# EAGLE design miniga_v1.1 (EAGLE 4.16)
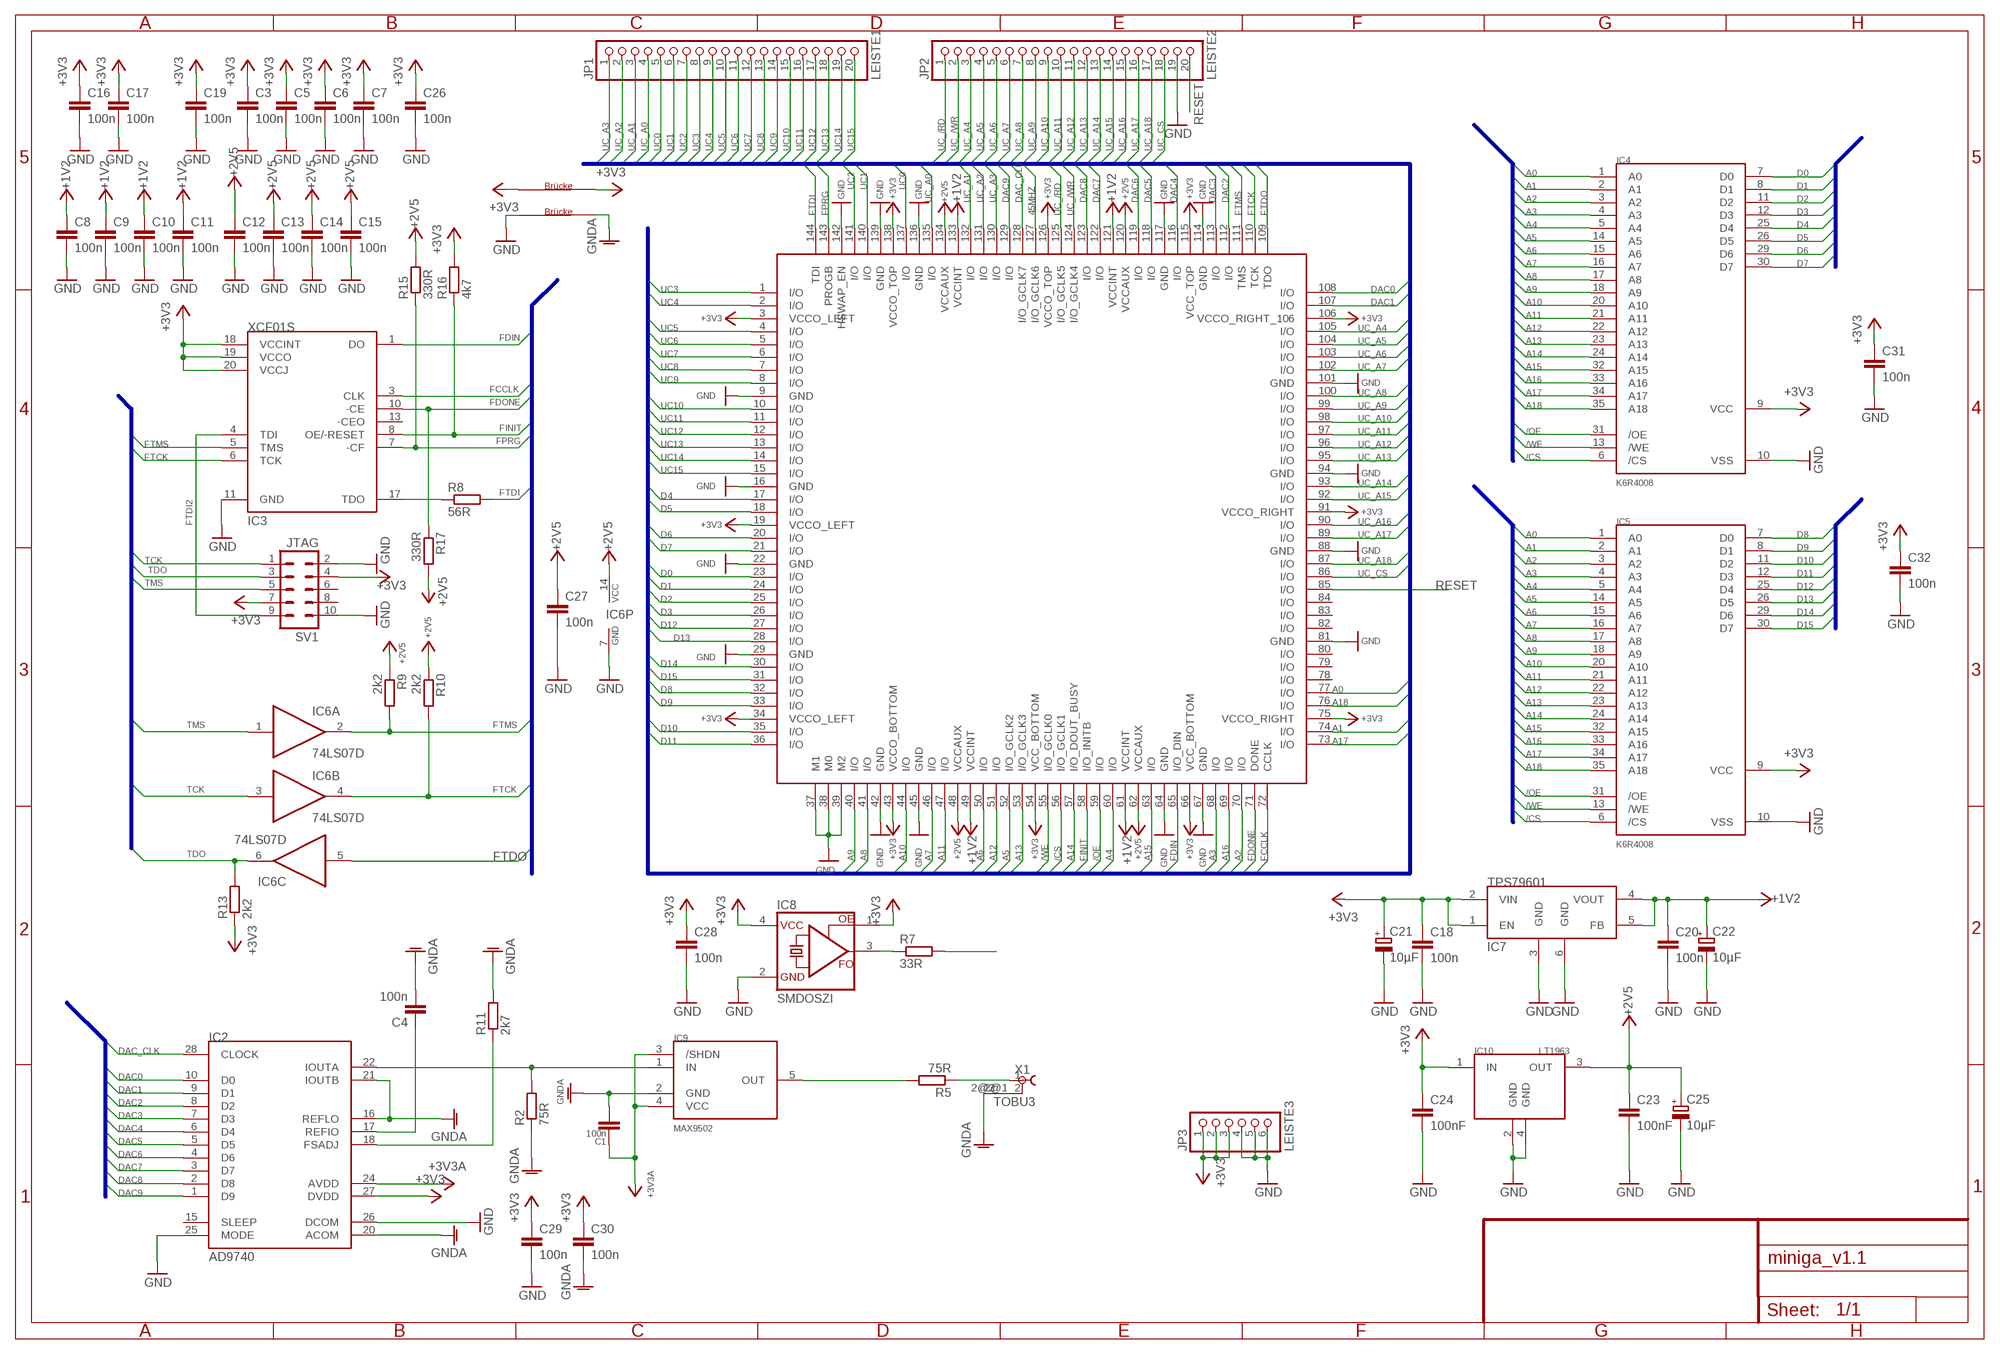
[diagram p0: schematic, sheet 1]

## Parts
C1  100n  C-EUC1206  [C1206]
C3  100n  C-EUC0603  [C0603]
C4  100n  C-EUC1206  [C1206]
C5  100n  C-EUC0603  [C0603]
C6  100n  C-EUC0603  [C0603]
C7  100n  C-EUC0603  [C0603]
C8  100n  C-EUC0603  [C0603]
C9  100n  C-EUC0603  [C0603]
C10  100n  C-EUC0603  [C0603]
C11  100n  C-EUC0603  [C0603]
C12  100n  C-EUC0603  [C0603]
C13  100n  C-EUC0603  [C0603]
C14  100n  C-EUC0603  [C0603]
C15  100n  C-EUC0603  [C0603]
C16  100n  C-EUC0603  [C0603]
C17  100n  C-EUC0603  [C0603]
C18  100n  C-EUC1206  [C1206]
C19  100n  C-EUC0603  [C0603]
C20  100n  C-EUC1206  [C1206]
C21  10µF  CPOL-EUCT6032  [CT6032]
C22  10µF  CPOL-EUCT6032  [CT6032]
C23  100nF  C-EUC1206  [C1206]
C24  100nF  C-EUC1206  [C1206]
C25  10µF  CPOL-EUCT6032  [CT6032]
C26  100n  C-EUC0603  [C0603]
C27  100n  C-EUC1206  [C1206]
C28  100n  C-EUC1206  [C1206]
C29  100n  C-EUC0603  [C0603]
C30  100n  C-EUC0603  [C0603]
C31  100n  C-EUC0603  [C0603]
C32  100n  C-EUC0603  [C0603]
IC1  XC3S200  [TQFP144]
IC2  AD9740  [SOIC28L]
IC3  XCF01S  [TSSOP20]
IC4  K6R4008  [SOJ36]
IC5  K6R4008  [SOJ36]
IC6  74LS07D  [SO14]
IC7  TPS79601  [SOT223-6]
IC8  SMDOSZI  [CRYSTAL]
IC9  MAX9502  [SC70-5]
IC10  LT1963  [SOT223]
JP1  LEISTE1  PINHD-1X20  [1X20]
JP2  LEISTE2  PINHD-1X20  [1X20]
JP3  LEISTE3  PINHD-1X6  [1X06]
JP4  BRUECKE  [BRUECKE]
JP5  BRUECKE  [BRUECKE]
R2  75R  R-EU_M1206  [M1206]
R5  75R  R-EU_M1206  [M1206]
R7  33R  R-EU_R1206  [R1206]
R8  56R  R-EU_M1206  [M1206]
R9  2k2  R-EU_R1206  [R1206]
R10  2k2  R-EU_R1206  [R1206]
R11  2k7  R-EU_M1206  [M1206]
R13  2k2  R-EU_R1206  [R1206]
R15  330R  R-EU_R1206  [R1206]
R16  4k7  R-EU_R1206  [R1206]
R17  330R  R-EU_R1206  [R1206]
SV1  JTAG  ML10  [ML10]
X1  TOBU3  [TOBU3]

## Nets
45MHZ: IC1.127(I/O_GCLK6) R7.2
+1V2: C8.1 C9.1 C10.1 C11.1 C20.1 C22.+ IC1.49(VCCINT) IC1.61(VCCINT) IC1.121(VCCINT) IC1.133(VCCINT) IC7.4(VOUT) IC7.5(FB)
+2V5: C12.1 C13.1 C14.1 C15.1 C23.1 C25.+ C27.1 IC1.48(VCCAUX) IC1.62(VCCAUX) IC1.120(VCCAUX) IC1.134(VCCAUX) IC6.14(P:VCC) IC10.3(OUT) R9.1 R10.1 R15.2 R17.2
+3V3: C3.1 C5.1 C6.1 C7.1 C16.1 C17.1 C18.1 C19.1 C21.+ C24.1 C26.1 C28.1 C29.1 C31.1 C32.1 IC1.3(VCCO_LEFT) IC1.19(VCCO_LEFT) IC1.34(VCCO_LEFT) IC1.43(VCCO_BOTTOM) IC1.54(VCC_BOTTOM) IC1.66(VCC_BOTTOM) IC1.75(VCCO_RIGHT) IC1.91(VCCO_RIGHT) IC1.106(VCCO_RIGHT_106) IC1.115(VCC_TOP) IC1.126(VCCO_TOP) IC1.138(VCCO_TOP) IC2.27(DVDD) IC3.18(VCCINT) IC3.19(VCCO) IC3.20(VCCJ) IC4.9(VCC) IC5.9(VCC) IC7.1(EN) IC7.2(VIN) IC8.1(OE) IC8.4(VCC) IC10.1(IN) JP3.1 JP3.2 JP3.3 JP4.1 R13.1 R16.2 SV1.4 SV1.7
+3V3A: C1.1 C30.1 IC2.24(AVDD) IC9.3(/SHDN) IC9.4(VCC) JP4.2 ; supply symbol labelled +3V3
/CS: IC1.56(I/O_GCLK1) IC4.6(/CS) IC5.6(/CS)
/OE: IC1.59(I/O) IC4.31(/OE) IC5.31(/OE)
/WE: IC1.55(I/O_GCLK0) IC4.13(/WE) IC5.13(/WE)
A0: IC1.77(I/O) IC4.1(A0) IC5.1(A0)
A1: IC1.74(I/O) IC4.2(A1) IC5.2(A1)
A2: IC1.70(I/O) IC4.3(A2) IC5.3(A2)
A3: IC1.68(I/O) IC4.4(A3) IC5.4(A3)
A4: IC1.60(I/O) IC4.5(A4) IC5.5(A4)
A5: IC1.52(I/O_GCLK2) IC4.14(A5) IC5.14(A5)
A6: IC1.50(I/O) IC4.15(A6) IC5.15(A6)
A7: IC1.46(I/O) IC4.16(A7) IC5.16(A7)
A8: IC1.41(I/O) IC4.17(A8) IC5.17(A8)
A9: IC1.40(I/O) IC4.18(A9) IC5.18(A9)
A10: IC1.44(I/O) IC4.20(A10) IC5.20(A10)
A11: IC1.47(I/O) IC4.21(A11) IC5.21(A11)
A12: IC1.51(I/O) IC4.22(A12) IC5.22(A12)
A13: IC1.53(I/O_GCLK3) IC4.23(A13) IC5.23(A13)
A14: IC1.57(I/O_DOUT_BUSY) IC4.24(A14) IC5.24(A14)
A15: IC1.63(I/O) IC4.32(A15) IC5.32(A15)
A16: IC1.69(I/O) IC4.33(A16) IC5.33(A16)
A17: IC1.73(I/O) IC4.34(A17) IC5.34(A17)
A18: IC1.76(I/O) IC4.35(A18) IC5.35(A18)
D0: IC1.23(I/O) IC4.7(D0)
D1: IC1.24(I/O) IC4.8(D1)
D2: IC1.25(I/O) IC4.11(D2)
D3: IC1.26(I/O) IC4.12(D3)
D4: IC1.17(I/O) IC4.25(D4)
D5: IC1.18(I/O) IC4.26(D5)
D6: IC1.20(I/O) IC4.29(D6)
D7: IC1.21(I/O) IC4.30(D7)
D8: IC1.32(I/O) IC5.7(D0)
D9: IC1.33(I/O) IC5.8(D1)
D10: IC1.35(I/O) IC5.11(D2)
D11: IC1.36(I/O) IC5.12(D3)
D12: IC1.27(I/O) IC5.25(D4)
D13: IC1.28(I/O) IC5.26(D5)
D14: IC1.30(I/O) IC5.29(D6)
D15: IC1.31(I/O) IC5.30(D7)
DAC0: IC1.108(I/O) IC2.10(D0)
DAC1: IC1.107(I/O) IC2.9(D1)
DAC2: IC1.112(I/O) IC2.8(D2)
DAC3: IC1.113(I/O) IC2.7(D3)
DAC4: IC1.116(I/O) IC2.6(D4)
DAC5: IC1.118(I/O) IC2.5(D5)
DAC6: IC1.119(I/O) IC2.4(D6)
DAC7: IC1.122(I/O) IC2.3(D7)
DAC8: IC1.123(I/O) IC2.2(D8)
DAC9: IC1.129(I/O) IC2.1(D9)
DAC_CLK: IC1.128(I/O_GCLK7) IC2.28(CLOCK)
FCCLK: IC1.72(CCLK) IC3.3(CLK)
FDIN: IC1.65(I/O_DIN) IC3.1(DO)
FDONE: IC1.71(DONE) IC3.10(-CE) R17.1
FINIT: IC1.58(I/O_INITB) IC3.8(OE/-RESET) R16.1
FPRG: IC1.143(PROGB) IC3.7(-CF) R15.1
FTCK: IC1.110(TCK) IC3.6(TCK) IC6.4(B:O) R10.2
FTDI: IC1.144(TDI) R8.2
FTDI2: IC3.4(TDI) SV1.9
FTDO: IC1.109(TDO) IC6.5(C:I)
FTMS: IC1.111(TMS) IC3.5(TMS) IC6.2(A:O) R9.2
GND: C3.2 C5.2 C6.2 C7.2 C8.2 C9.2 C10.2 C11.2 C12.2 C13.2 C14.2 C15.2 C16.2 C17.2 C18.2 C19.2 C20.2 C21.- C22.- C23.2 C24.2 C25.- C26.2 C27.2 C28.2 C29.2 C31.2 C32.2 IC1.9(GND) IC1.16(GND) IC1.22(GND) IC1.29(GND) IC1.37(M1) IC1.38(M0) IC1.39(M2) IC1.42(GND) IC1.45(GND) IC1.64(GND) IC1.67(GND) IC1.81(GND) IC1.88(GND) IC1.94(GND) IC1.101(GND) IC1.114(GND) IC1.117(GND) IC1.136(GND) IC1.139(GND) IC1.142(HSWAP_EN) IC2.25(MODE) IC2.26(DCOM) IC3.11(GND) IC4.10(VSS) IC5.10(VSS) IC6.7(P:GND) IC7.3(GND) IC7.6(GND) IC8.2(GND) IC10.2(GND) IC10.4(GND) JP2.19 JP3.4 JP3.5 JP3.6 JP5.1 SV1.2 SV1.10
GNDA: C1.2 C4.2 C30.2 IC2.16(REFLO) IC2.20(ACOM) IC2.21(IOUTB) IC9.2(GND) JP5.2 R2.1 R11.2 X1.2@2
N$3: IC9.5(OUT) R5.2
N$4: C4.1 IC2.17(REFIO)
N$6: R5.1 X1.1
N$7: IC8.3(FO) R7.1
N$8: IC3.17(TDO) R8.1
N$9: IC2.22(IOUTA) IC9.1(IN) R2.2
N$12: IC2.18(FSADJ) R11.1
RESET: IC1.85(I/O) JP2.20
TCK: IC6.3(B:I) SV1.1
TDO: IC6.6(C:O) R13.2 SV1.3
TMS: IC6.1(A:I) SV1.5
UC0: IC1.137(I/O) JP1.5
UC1: IC1.140(I/O) JP1.6
UC2: IC1.141(I/O) JP1.7
UC3: IC1.1(I/O) JP1.8
UC4: IC1.2(I/O) JP1.9
UC5: IC1.4(I/O) JP1.10
UC6: IC1.5(I/O) JP1.11
UC7: IC1.6(I/O) JP1.12
UC8: IC1.7(I/O) JP1.13
UC9: IC1.8(I/O) JP1.14
UC10: IC1.10(I/O) JP1.15
UC11: IC1.11(I/O) JP1.16
UC12: IC1.12(I/O) JP1.17
UC13: IC1.13(I/O) JP1.18
UC14: IC1.14(I/O) JP1.19
UC15: IC1.15(I/O) JP1.20
UC_/RD: IC1.125(I/O_GCLK5) JP2.1
UC_/WR: IC1.124(I/O_GCLK4) JP2.2
UC_A0: IC1.135(I/O) JP1.4
UC_A1: IC1.132(I/O) JP1.3
UC_A2: IC1.131(I/O) JP1.2
UC_A3: IC1.130(I/O) JP1.1
UC_A4: IC1.105(I/O) JP2.3
UC_A5: IC1.104(I/O) JP2.4
UC_A6: IC1.103(I/O) JP2.5
UC_A7: IC1.102(I/O) JP2.6
UC_A8: IC1.100(I/O) JP2.7
UC_A9: IC1.99(I/O) JP2.8
UC_A10: IC1.98(I/O) JP2.9
UC_A11: IC1.97(I/O) JP2.10
UC_A12: IC1.96(I/O) JP2.11
UC_A13: IC1.95(I/O) JP2.12
UC_A14: IC1.93(I/O) JP2.13
UC_A15: IC1.92(I/O) JP2.14
UC_A16: IC1.90(I/O) JP2.15
UC_A17: IC1.89(I/O) JP2.16
UC_A18: IC1.87(I/O) JP2.17
UC_CS: IC1.86(I/O) JP2.18
Unconnected: IC1.78(I/O) IC1.79(I/O) IC1.80(I/O) IC1.82(I/O) IC1.83(I/O) IC1.84(I/O) IC2.15(SLEEP) IC3.13(-CEO) IC6.8(D:O) IC6.9(D:I) IC6.10(E:O) IC6.11(E:I) IC6.12(F:O) IC6.13(F:I) SV1.6 SV1.8 X1.2 X1.2@1

## Buses
FDIN,FCCLK,FDONE,FINIT,FPRG,FTDI,FTDO,FTMS,FTCK,FDOUT,A[0..18],D[0..15],/OE,/WE,/CS,UC[0..15],UC_A[0..18],DAC[0..9],DACCLK,UC_/RD,UC_/WR,UC_CS
A[0..18],/OE,/WE,/CS
D[0..15]
DAC[0..9],DAC_CLK
B$1
B$2

## Library data of the parts
C1 C3-C20 C23 C24 C26-C32 = rcl:C-EU: CAPACITOR, European symbol
C21 C22 C25 = rcl:CPOL-EU: POLARIZED CAPACITOR, European symbol
IC1 = mylib:XC3S200
IC2 = mylib:AD9740
IC3 = mylib:XCF01S
IC4 IC5 = mylib:K6R4008
IC6 = 74xx-eu:74*07: Hex BUFFER, open collector high-voltage output
IC7 = mylib:TPS79601
IC8 = mylib:SMDOSZI
IC9 = mylib:MAX9502
IC10 = mylib:LT1963
JP1 JP2 = pinhead:PINHD-1X20: PIN HEADER
JP3 = pinhead:PINHD-1X6: PIN HEADER
JP4 JP5 = mylib:BRUECKE
R2 R5 R7-R11 R13 R15-R17 = rcl:R-EU_: RESISTOR, European symbol
SV1 = con-harting-ml:ML10: HARTING
X1 = con-hirschmann:TOBU3: Female Cinch CONNECTOR

## Board
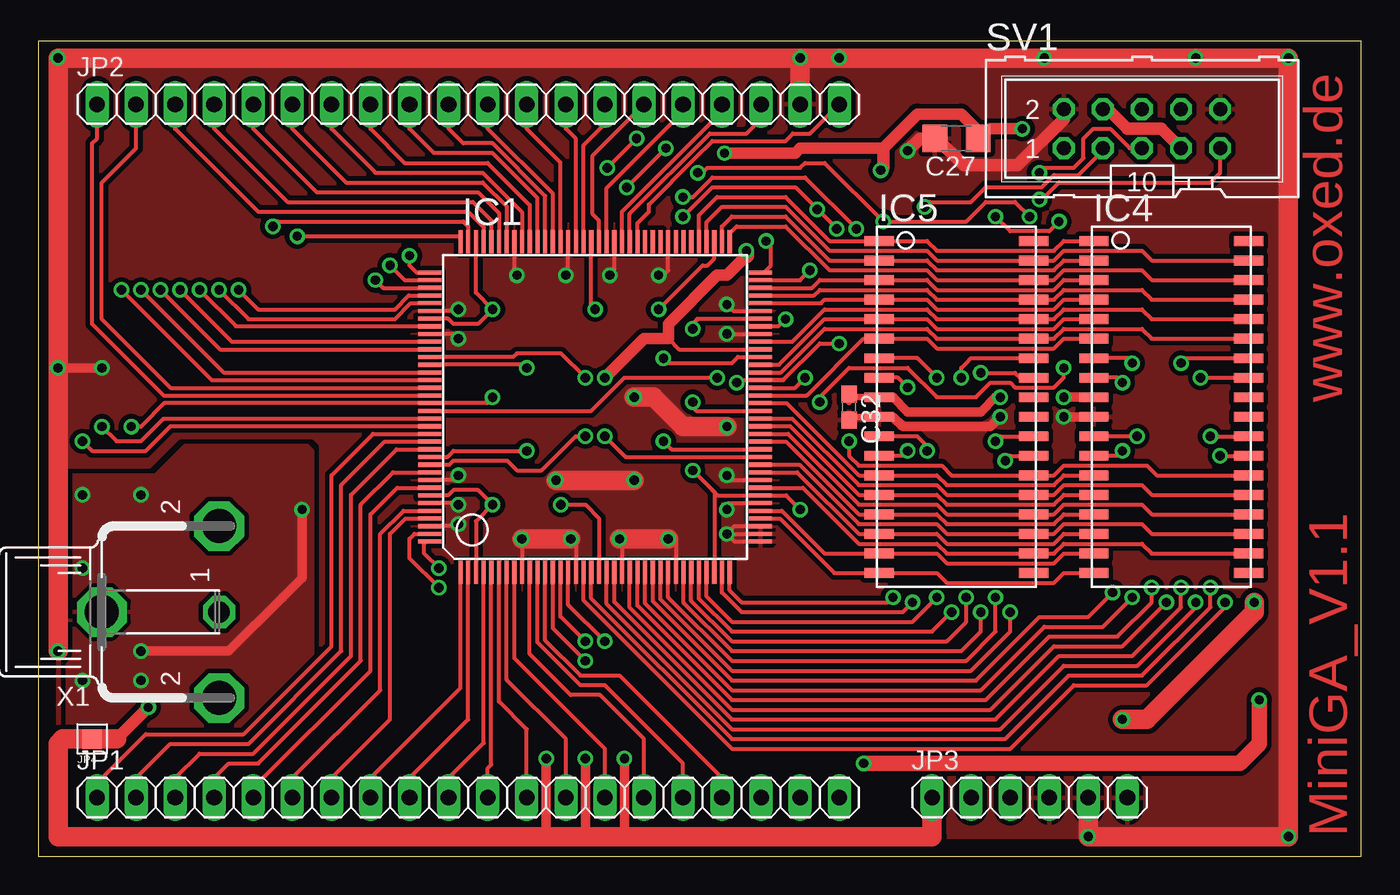
[diagram p1: board, top side]
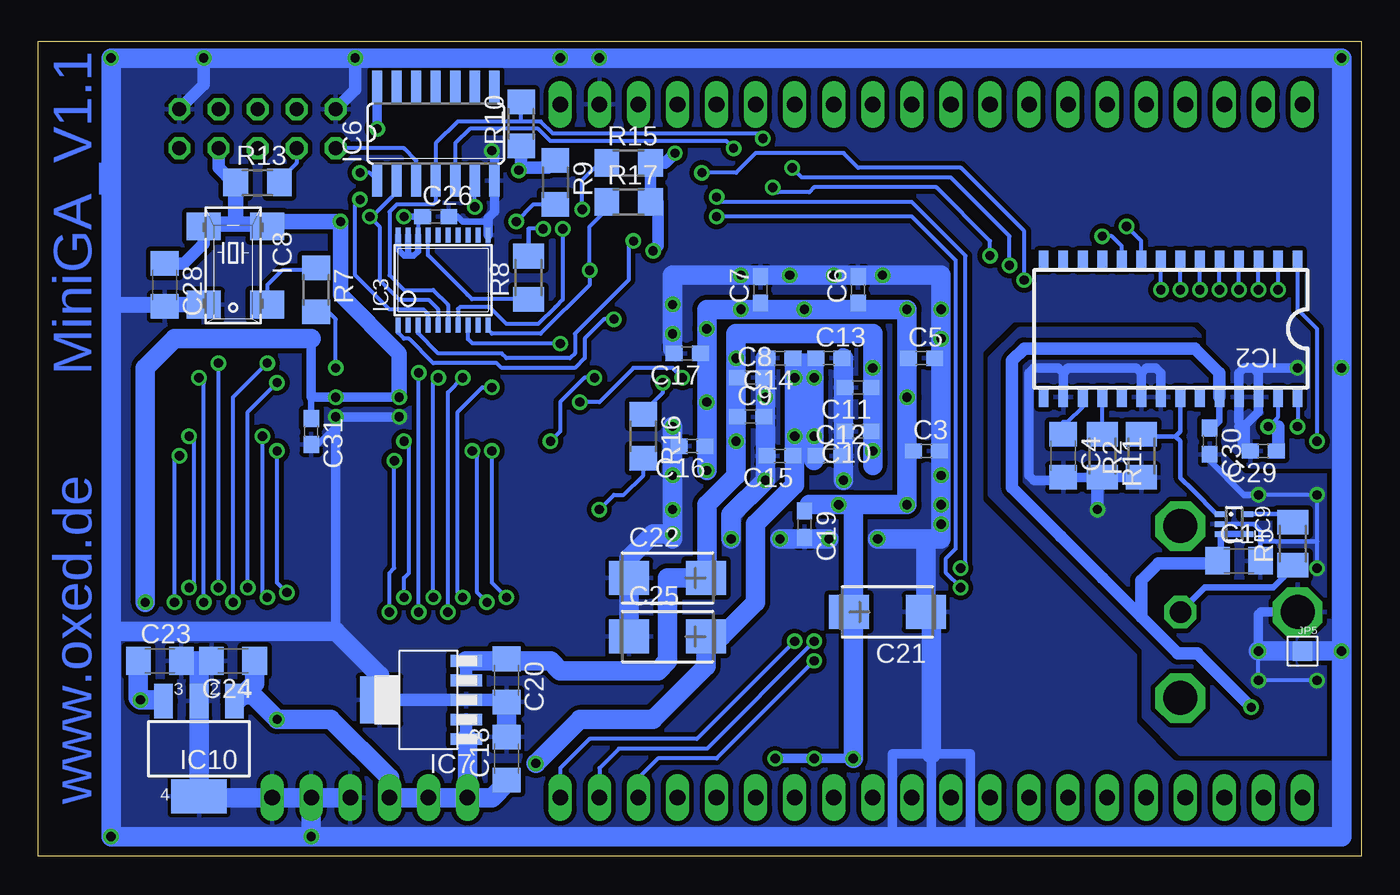
[diagram p2: board, bottom side, seen from below]

Size 86 x 53 mm. Coordinates in mm from the lower left corner, seen from the top.
Outline: 0,0 86,0 86,53 0,53 0,0
Copper layers (1*16): Top 0.035mm / dielectric 1.5mm / Bottom 0.035mm
Design rules "default": minimum track width 6mil, minimum drill 0.6mm, track to track 0.15mm, track to pad 0.15mm, pad to pad 0.15mm, via to via 0.15mm, smd to smd 0.15mm, copper to edge 10mil, drill to drill 8mil, minimum pad ring 10mil, minimum via ring 8mil, stop-mask expansion 4mil, vias tented up to drill 0mil, thermal gap 10mil

### Footprints (pad centres in the part's own frame; a part is rotated, then mirrored left to right if it is on the bottom)
C1206 = smd 1.6 x 1.8: 1 -1.4,0; 2 1.4,0
C0603 = smd 1.1 x 1: 1 -0.85,0; 2 0.85,0
CT6032 = smd 2.6 x 2.2: + 2.5,0; - -2.5,0
TQFP144 = smd 0.27 x 1.5: 1 -8.75,-10.75; 2 -8.25,-10.75; 3 -7.75,-10.75; 4 -7.25,-10.75; 5 -6.75,-10.75; 6 -6.25,-10.75; 7 -5.75,-10.75; 8 -5.25,-10.75; 9 -4.75,-10.75; 10 -4.25,-10.75; 11 -3.75,-10.75; 12 -3.25,-10.75; 13 -2.75,-10.75; 14 -2.25,-10.75; 15 -1.75,-10.75; 16 -1.25,-10.75; 17 -0.75,-10.75; 18 -0.25,-10.75; 19 0.25,-10.75; 20 0.75,-10.75; 21 1.25,-10.75; 22 1.75,-10.75; 23 2.25,-10.75; 24 2.75,-10.75; 25 3.25,-10.75; 26 3.75,-10.75; 27 4.25,-10.75; 28 4.75,-10.75; 29 5.25,-10.75; 30 5.75,-10.75; 31 6.25,-10.75; 32 6.75,-10.75; 33 7.25,-10.75; 34 7.75,-10.75; 35 8.25,-10.75; 36 8.75,-10.75; 73 8.75,10.75; 74 8.25,10.75; 75 7.75,10.75; 76 7.25,10.75; 77 6.75,10.75; 78 6.25,10.75; 79 5.75,10.75; 80 5.25,10.75; 81 4.75,10.75; 82 4.25,10.75; 83 3.75,10.75; 84 3.25,10.75; 85 2.75,10.75; 86 2.25,10.75; 87 1.75,10.75; 88 1.25,10.75; 89 0.75,10.75; 90 0.25,10.75; 91 -0.25,10.75; 92 -0.75,10.75; 93 -1.25,10.75; 94 -1.75,10.75; 95 -2.25,10.75; 96 -2.75,10.75; 97 -3.25,10.75; 98 -3.75,10.75; 99 -4.25,10.75; 100 -4.75,10.75; 101 -5.25,10.75; 102 -5.75,10.75; 103 -6.25,10.75; 104 -6.75,10.75; 105 -7.25,10.75; 106 -7.75,10.75; 107 -8.25,10.75; 108 -8.75,10.75 | smd 1.5 x 0.27: 37 10.75,-8.75; 38 10.75,-8.25; 39 10.75,-7.75; 40 10.75,-7.25; 41 10.75,-6.75; 42 10.75,-6.25; 43 10.75,-5.75; 44 10.75,-5.25; 45 10.75,-4.75; 46 10.75,-4.25; 47 10.75,-3.75; 48 10.75,-3.25; 49 10.75,-2.75; 50 10.75,-2.25; 51 10.75,-1.75; 52 10.75,-1.25; 53 10.75,-0.75; 54 10.75,-0.25; 55 10.75,0.25; 56 10.75,0.75; 57 10.75,1.25; 58 10.75,1.75; 59 10.75,2.25; 60 10.75,2.75; 61 10.75,3.25; 62 10.75,3.75; 63 10.75,4.25; 64 10.75,4.75; 65 10.75,5.25; 66 10.75,5.75; 67 10.75,6.25; 68 10.75,6.75; 69 10.75,7.25; 70 10.75,7.75; 71 10.75,8.25; 72 10.75,8.75; 109 -10.75,8.75; 110 -10.75,8.25; 111 -10.75,7.75; 112 -10.75,7.25; 113 -10.75,6.75; 114 -10.75,6.25; 115 -10.75,5.75; 116 -10.75,5.25; 117 -10.75,4.75; 118 -10.75,4.25; 119 -10.75,3.75; 120 -10.75,3.25; 121 -10.75,2.75; 122 -10.75,2.25; 123 -10.75,1.75; 124 -10.75,1.25; 125 -10.75,0.75; 126 -10.75,0.25; 127 -10.75,-0.25; 128 -10.75,-0.75; 129 -10.75,-1.25; 130 -10.75,-1.75; 131 -10.75,-2.25; 132 -10.75,-2.75; 133 -10.75,-3.25; 134 -10.75,-3.75; 135 -10.75,-4.25; 136 -10.75,-4.75; 137 -10.75,-5.25; 138 -10.75,-5.75; 139 -10.75,-6.25; 140 -10.75,-6.75; 141 -10.75,-7.25; 142 -10.75,-7.75; 143 -10.75,-8.25; 144 -10.75,-8.75
SOIC28L = smd 1.27 x 0.635: 1 -4.445,8.255; 2 -4.445,6.985; 3 -4.445,5.715; 4 -4.445,4.445; 5 -4.445,3.175; 6 -4.445,1.905; 7 -4.445,0.635; 8 -4.445,-0.635; 9 -4.445,-1.905; 10 -4.445,-3.175; 11 -4.445,-4.445; 12 -4.445,-5.715; 13 -4.445,-6.985; 14 -4.445,-8.255; 15 4.445,-8.255; 16 4.445,-6.985; 17 4.445,-5.715; 18 4.445,-4.445; 19 4.445,-3.175; 20 4.445,-1.905; 21 4.445,-0.635; 22 4.445,0.635; 23 4.445,1.905; 24 4.445,3.175; 25 4.445,4.445; 26 4.445,5.715; 27 4.445,6.985; 28 4.445,8.255
TSSOP20 = smd 0.305 x 0.991: 1 -2.925,-2.918; 2 -2.275,-2.918; 3 -1.625,-2.918; 4 -0.975,-2.918; 5 -0.325,-2.918; 6 0.325,-2.918; 7 0.975,-2.918; 8 1.625,-2.918; 9 2.275,-2.918; 10 2.925,-2.918; 11 2.925,2.918; 12 2.275,2.918; 13 1.625,2.918; 14 0.975,2.918; 15 0.325,2.918; 16 -0.325,2.918; 17 -0.975,2.918; 18 -1.625,2.918; 19 -2.275,2.918; 20 -2.925,2.918
SOJ36 = smd 0.635 x 1.905: 1 -10.16,-5.029; 2 -8.89,-5.029; 3 -7.62,-5.029; 4 -6.35,-5.029; 5 -5.08,-5.029; 6 -3.81,-5.029; 7 -2.54,-5.029; 8 -1.27,-5.029; 9 0,-5.029; 10 1.27,-5.029; 11 2.54,-5.029; 12 3.81,-5.029; 13 5.08,-5.029; 14 6.35,-5.029; 15 7.62,-5.029; 16 8.89,-5.029; 17 10.16,-5.029; 18 11.43,-5.029; 19 11.43,5.029; 20 10.16,5.029; 21 8.89,5.029; 22 7.62,5.029; 23 6.35,5.029; 24 5.08,5.029; 25 3.81,5.029; 26 2.54,5.029; 27 1.27,5.029; 28 0,5.029; 29 -1.27,5.029; 30 -2.54,5.029; 31 -3.81,5.029; 32 -5.08,5.029; 33 -6.35,5.029; 34 -7.62,5.029; 35 -8.89,5.029; 36 -10.16,5.029
SO14 = smd 0.66 x 2.032: 1 -3.81,-3.073; 2 -2.54,-3.073; 3 -1.27,-3.073; 4 0,-3.073; 5 1.27,-3.073; 6 2.54,-3.073; 7 3.81,-3.073; 8 3.81,3.073; 9 2.54,3.073; 10 1.27,3.073; 11 0,3.073; 12 -1.27,3.073; 13 -2.54,3.073; 14 -3.81,3.073
SOT223-6 = smd 0.762 x 2.032: 1 -2.54,-3.099; 2 -1.27,-3.099; 3 0,-3.099; 4 1.27,-3.099; 5 2.54,-3.099 | smd 3.048 x 2.54: 6 0,2.54
CRYSTAL = smd 1.8 x 2.2: 1 -2.54,-2.857; 2 2.54,-2.857; 3 2.54,1.27; 4 -2.54,1.27
SC70-5 = smd 0.35 x 0.8: 1 -0.65,-0.85; 2 0,-0.85; 3 0.65,-0.85; 4 0.65,0.85; 5 -0.65,0.85
SOT223 = smd 1.219 x 2.235: 1 -2.311,-3.099; 2 0,-3.099; 3 2.311,-3.099 | smd 3.6 x 2.2: 4 0,3.099
1X20 = drill 1.016 long: 1 -24.13,0; 2 -21.59,0; 3 -19.05,0; 4 -16.51,0; 5 -13.97,0; 6 -11.43,0; 7 -8.89,0; 8 -6.35,0; 9 -3.81,0; 10 -1.27,0; 11 1.27,0; 12 3.81,0; 13 6.35,0; 14 8.89,0; 15 11.43,0; 16 13.97,0; 17 16.51,0; 18 19.05,0; 19 21.59,0; 20 24.13,0
1X06 = drill 1.016 long: 1 -6.35,0; 2 -3.81,0; 3 -1.27,0; 4 1.27,0; 5 3.81,0; 6 6.35,0
BRUECKE = smd 0.635 x 1.27: 1 0,0; 2 0.635,0
M1206 = smd 1.6 x 2: 1 -1.4,0; 2 1.4,0
R1206 = smd 1.6 x 1.803: 1 -1.422,0; 2 1.422,0
ML10 = drill 0.914 octagon: 1 -5.08,-1.27; 2 -5.08,1.27; 3 -2.54,-1.27; 4 -2.54,1.27; 5 0,-1.27; 6 0,1.27; 7 2.54,-1.27; 8 2.54,1.27; 9 5.08,-1.27; 10 5.08,1.27
TOBU3 = drill 1.397 octagon: 1 0,-2.54 | drill 2.21 octagon: 2 5.588,-2.54; 2@1 -5.588,-2.54; 2@2 0,5.08

### Placement (x,y rotation side)
C1  7.94,19.21 0 bottom
C3  28.26,26.35 0 bottom
C4  19.37,26.04 270 bottom
C5  28.57,32.38 0 bottom
C6  32.7,36.83 90 bottom
C7  39.05,36.83 90 bottom
C8  39.69,31.11 0 bottom
C9  39.69,28.57 0 bottom
C10  32.7,27.62 180 bottom
C11  32.7,30.48 180 bottom
C12  34.61,26.04 0 bottom
C13  34.61,32.38 0 bottom
C14  37.78,32.38 180 bottom
C15  37.78,26.04 180 bottom
C16  43.5,26.67 180 bottom
C17  43.81,32.7 180 bottom
C18  55.56,6.35 90 bottom
C19  36.2,21.59 270 bottom
C20  55.56,11.43 270 bottom
C21  30.8,15.88 180 bottom
C22  45.09,18.1 0 bottom
C23  78.11,12.7 0 bottom
C24  73.34,12.7 180 bottom
C25  45.09,14.29 0 bottom
C26  60.17,41.59 0 bottom
C27  59.69,46.67 180 top
C28  77.79,37.15 270 bottom
C29  6.35,26.35 180 bottom
C30  9.84,26.99 270 bottom
C31  68.26,27.62 270 bottom
C32  52.7,29.21 270 top
IC1  36.2,29.21 0 top
IC2  12.38,34.29 270 bottom
IC3  59.69,37.47 0 bottom
IC4  73.66,29.84 270 top
IC5  59.69,29.84 270 top
IC6  60.17,46.99 0 bottom
IC7  61.28,10.16 90 bottom
IC8  72.39,38.42 270 bottom
IC9  8.26,21.59 270 bottom
IC10  75.56,6.99 180 bottom
JP1  27.94,3.81 0 top
JP2  27.94,48.9 0 top
JP3  64.45,3.81 0 top
JP4  3.17,7.62 0 top
JP5  3.49,13.34 180 bottom
R2  14.29,26.04 90 bottom
R5  4.45,20.32 90 bottom
R7  67.94,36.83 270 bottom
R8  54.13,37.62 90 bottom
R9  52.39,43.81 270 bottom
R10  54.61,47.63 90 bottom
R11  16.83,26.04 270 bottom
R13  71.75,43.81 0 bottom
R15  47.62,45.09 0 bottom
R16  46.67,27.3 270 bottom
R17  47.62,42.55 0 bottom
SV1  71.75,47.31 0 top
X1  9.21,15.88 90 top

### Tracks (layer width: path | path; a pad name or v marks a point on that pad's centre or on a via)
45MHZ  (via drill 0.6)
  Top 0.254: IC1.127 35.95,28.96 38.1,31.11 v44.13,31.11 | v66.67,31.75 66.67,31.11 66.04,30.48 63.5,30.48 63.18,30.8 61.91,30.8 60.96,29.84 58.42,29.84 56.52,31.75 52.7,31.75 50.8,29.84 v50.8,29.53
  Bottom 0.254: R7.2 67.16,35.41 66.67,34.92 v66.67,31.75 | v44.13,31.11 44.77,31.75 47.31,31.75 49.53,29.53 v50.8,29.53
+1V2  (via drill 0.6)
  Top 0.254: IC1.61 45.48,32.46 45.09,32.07 40.96,32.07 v40.64,32.38 | IC1.49 41.17,26.46 v40.64,26.99 | IC1.121 31.54,31.96 v31.75,31.75 | IC1.133 26.59,25.96 26.99,26.35 v31.75,26.35
  Bottom 0.254: C11.1 32.07,30.48 31.75,30.8 v31.75,31.75 | C10.1 32.07,27.62 31.75,27.3 v31.75,26.35 | C8.1 40.54,32.28 v40.64,32.38 | C9.1 40.54,27.09 v40.64,26.99
  Bottom 0.813: IC7.5 58.1,12.7 58.18,12.62 IC7.4
  Bottom 1.27: 31.75,25.4 v31.75,26.35 v31.75,31.75 31.75,33.97 40.64,33.97 v40.64,32.38 v40.64,26.99 40.64,24.77 42.55,22.86 42.55,18.1 C22.+ 45.09,18.1 45.09,12.7 45.72,12.06 52.07,12.06 52.7,12.7 55.56,12.7 | 55.56,12.7 IC7.5 | 55.56,12.7 C20.1
+2V5  (via drill 0.6)
  Top 0.254: IC1.62 41.65,32.96 40.96,33.66 | IC1.120 30.87,32.46 31.11,32.7 33.97,32.7 v35.56,31.11 | IC1.134 26.73,25.46 26.99,25.72 30.48,25.72 31.11,25.08 32.7,25.08 34.92,27.3 v35.56,27.3 | IC1.48 38.17,25.96 v36.83,27.3 | C27.1 61.28,46.67 61.91,47.31
  Top 0.762: v36.83,31.11 39.37,33.66 40.96,33.66 40.96,34.61 44.13,37.78 44.77,37.78 46.04,39.05 | 61.91,47.31 v63.98,47.31 | C27.1 61.09,47.18 60.01,48.26 57.15,48.26 54.93,46.04 49.53,46.04 49.21,45.72 v44.61,45.72
  Top 0.813: 54.93,46.04 54.93,44.77 v54.77,44.61
  Top 1.016: v53.66,6.03 78.11,6.03 79.38,7.3 v79.38,10.16 | 46.04,39.05 v46.04,39.37
  Bottom 0.254: 35.56,26.04 C12.1 | 36.83,26.04 C15.1 | C13.1 35.46,32.17 35.56,32.07 | C14.1 36.93,32.17 36.83,32.07 | 45.72,42.55 R17.2
  Bottom 0.61: v63.98,47.31 | v63.98,47.31 IC6.14
  Bottom 0.762: 46.2,42.54 R17.2 R15.2 45.24,45.09 v44.61,45.72 | 45.72,42.55 45.72,39.69 v46.04,39.37
  Bottom 0.813: R9.1 52.86,44.77 54.61,44.77 v54.77,44.61 54.61,44.77 R10.1
  Bottom 1.27: 35.56,25.72 35.56,26.04 v35.56,27.3 v35.56,31.11 35.56,32.07 36.83,32.07 v36.83,31.11 v36.83,27.3 36.83,26.04 36.83,24.13 39.37,21.59 39.37,19.05 | 39.37,19.05 39.37,18.73 | 39.37,19.05 39.37,16.51 41.59,14.29 C25.+ | C25.+ 42.86,14.29 | C25.+ 42.59,12.34 46.04,8.89 50.8,8.89 v53.66,6.03 | C23.1 79.5,10.29 v79.38,10.16 78.11,10.16 78.03,10.08 IC10.3
+3V3  (via drill 0.6)
  Top 0.254: IC5.9 53.98,29.84 | v6.03,27.94 6.67,27.94 8.19,29.46 IC1.126 29.14,29.46 v29.53,29.84 | IC1.66 42.83,34.96 42.83,34.89 42.55,34.61 v42.55,34.29 | IC1.91 35.95,35.81 v36.2,35.56 | IC1.106 28.45,36.64 v29.53,35.56 28.57,34.61 26.99,34.61 26.64,34.96 IC1.115 | IC1.138 26.64,23.46 26.99,23.81 28.57,23.81 v29.53,22.86 28.45,21.78 IC1.3 | IC1.19 36.45,21.98 35.56,22.86 v33.97,22.86 | IC1.34 43.95,23.68 43.81,23.81 | v42.55,25.08 43.81,23.81 | v42.55,29.53 42.55,29.21 42.8,28.96 IC1.54 | 43.81,23.81 44.17,23.46 IC1.43 48.61,23.46 v49.53,22.54 | v66.36,41.27 65.72,40.64 63.18,40.64 v62.23,41.59 | IC1.75 43.95,38.87 43.5,38.42 43.18,38.42 v40.32,35.56
  Top 0.406: C32.1 52.7,29.53 53.02,29.84 53.98,29.84
  Top 0.61: v66.67,29.84 IC4.9 | v62.55,29.84 62.23,29.84 61.28,28.89 56.52,28.89 55.56,29.84 IC5.9 | 35.56,1.27 v35.56,6.35 | 33.02,1.27 v33.02,6.35 | 38.1,1.27 v38.1,6.35
  Top 0.813: SV1.4 69.53,48.58 70.8,47.31 73.03,47.31 SV1.7
  Top 1.27: v70.48,8.89 72.07,8.89 79.06,15.88 v79.06,16.51 | JP3.1 58.1,1.27 38.1,1.27 35.56,1.27 33.02,1.27 1.27,1.27 1.27,7.3 1.59,7.62 JP4.1
  Bottom 0.254: v6.03,27.94 5.4,28.57 IC2.27 | R16.2 46.67,24.77 47.94,23.5 48.58,23.5 v49.53,22.54 | IC3.18 61.31,41.47 61.44,41.59 | 73.18,43.01 R13.1
  Bottom 0.305: C19.1 36.2,22.54 35.88,22.86 | 29.53,26.35 C3.1 | C5.1 29.43,33.55 29.53,33.66 | C6.1 32.7,35.88 32.38,35.56 | C7.1 39.05,35.88 38.73,35.56 | C17.1 42.86,32.7 42.55,33.02 | 42.55,26.67 C16.1 | 58.1,7.62 58.18,7.7
  Bottom 0.406: IC3.18 61.31,39.33 61.59,39.05 61.91,39.05 | IC3.20 62.62,39.44 62.23,39.05 61.91,39.05 | IC3.19 61.97,39.1 61.91,39.05 | v62.23,41.59 61.44,41.59 C26.1 | 68.26,29.84 C31.1
  Bottom 0.61: v66.67,29.84 v62.55,29.84 68.26,29.84 68.26,33.66 | v33.02,6.35 v35.56,6.35 v38.1,6.35
  Bottom 0.813: 58.18,7.7 IC7.2 | C29.1 5.4,26.35 5.4,27.94 v6.03,27.94 | SV1.7 74.3,44.77 73.34,43.81 R13.1 | IC8.1 75.25,39.85 76.55,38.55 C28.1
  Bottom 1.016: v62.55,29.84 62.55,32.7 66.36,36.51 v66.36,41.27 70.96,41.27 71.12,41.12 | 71.12,41.12 IC8.4 | IC8.1 75.25,41.12 73.34,41.12 | 71.12,41.12 73.34,41.12 | 73.18,43.01 73.18,41.28 73.34,41.12
  Bottom 1.27: v42.55,25.08 42.55,26.67 v42.55,29.53 42.55,33.02 v42.55,34.29 42.55,35.56 v40.32,35.56 38.73,35.56 v36.2,35.56 32.38,35.56 v29.53,35.56 29.53,33.66 v29.53,29.84 29.53,26.35 v29.53,22.86 33.02,22.86 | 33.02,22.86 v33.97,22.86 35.88,22.86 | 33.02,15.88 C21.+ | 33.02,15.88 33.02,22.86 | C24.1 71.94,11.24 73.1,10.08 IC10.1 73.03,10.31 73.03,10.48 72.07,10.48 v70.48,8.89 66.99,8.89 63.18,5.08 JP3.3 JP3.2 JP3.1 | C18.1 55.56,4.76 56.52,3.81 JP3.1 | IC7.1 58.1,7.62 JP3.1 | v79.06,16.51 79.06,31.75 77.15,33.66 68.26,33.66 | v33.02,6.35 33.02,15.88
+3V3A  (via drill 0.6)
  Top 0.813: 5.08,7.62 v7.14,9.68
  Top 1.27: JP4.2 5.08,7.62
  Bottom 0.406: C30.1 9.84,27.62 9.21,28.26 IC2.24 | IC9.4 8.24,20.94 8.26,20.95 8.27,20.94 IC9.3 9.11,19.47 | C1.1 9.34,19.24 9.11,19.47 | 9.11,19.47 9.37,19.21 9.68,19.21 9.84,19.05
  Bottom 0.61: C1.1 9.53,19.02
  Bottom 0.813: IC2.24 9.21,31.43 10.79,33.02 21.91,33.02 22.7,32.23 22.7,23.97 19.53,20.8 16.83,18.1 14.29,15.56 | 9.84,19.05 13.18,19.05 14.29,17.94 14.29,15.56 | 14.29,15.56 11.91,13.18 10.64,13.18 v7.14,9.68
/CS
  Top 0.254: IC4.6 66.67,33.66 66.04,33.02 58.42,33.02 57.78,33.66 IC5.6 53.66,33.66 49.96,29.96 IC1.56
/OE
  Top 0.254: IC4.31 72.39,33.66 71.75,34.29 66.67,34.29 66.04,33.66 64.77,33.66 | 64.77,33.66 IC5.31 | 64.77,33.66 58.42,33.66 57.78,34.29 51.12,34.29 48.29,31.46 IC1.59
/WE
  Top 0.254: IC4.13 66.67,24.77 66.04,24.13 59.05,24.13 58.42,24.77 IC5.13 54.61,24.77 | 54.61,24.77 53.98,24.77 | IC1.55 48.65,29.46 53.34,24.77 54.61,24.77
A0
  Top 0.254: IC4.1 66.67,40.01 66.04,39.37 58.42,39.37 57.78,40.01 IC5.1 54.61,40.01 | 54.61,40.01 53.98,40.01 | IC1.77 42.95,41.67 44.13,42.86 48.58,42.86 51.44,40.01 54.61,40.01
A1
  Top 0.254: IC4.2 66.67,38.73 66.04,38.1 58.42,38.1 57.78,38.73 IC5.2 54.61,38.73 | 54.61,38.73 53.98,38.73 | IC1.74 44.45,40.95 45.09,41.59 48.58,41.59 51.44,38.73 54.61,38.73
A2
  Top 0.254: IC4.3 66.67,37.47 66.04,36.83 58.42,36.83 57.78,37.47 IC5.3 54.61,37.47 | 54.61,37.47 53.98,37.47 | IC1.70 50.3,36.96 50.8,37.47 54.61,37.47
A3
  Top 0.254: IC4.4 66.67,36.2 66.04,35.56 58.42,35.56 57.78,36.2 IC5.4 54.61,36.2 | 54.61,36.2 53.98,36.2 | IC1.68 50.88,35.96 51.12,36.2 54.61,36.2
A4
  Top 0.254: IC4.5 66.67,34.92 66.04,34.29 58.42,34.29 57.78,34.92 IC5.5 51.12,34.92 48.15,31.96 IC1.60
A5
  Top 0.254: IC4.14 66.67,23.5 66.04,22.86 59.05,22.86 58.42,23.5 IC5.14 54.61,23.5 | 54.61,23.5 53.98,23.5 | IC1.52 48.88,27.96 53.34,23.5 54.61,23.5
A6
  Top 0.254: IC4.15 66.67,22.23 66.04,21.59 59.05,21.59 58.42,22.23 IC5.15 54.61,22.23 | 54.61,22.23 53.98,22.23 | IC1.50 48.6,26.96 53.34,22.23 54.61,22.23
A7
  Top 0.254: IC4.16 66.67,20.95 66.04,20.32 59.05,20.32 58.42,20.95 IC5.16 54.61,20.95 | 54.61,20.95 53.98,20.95 | IC1.46 49.34,24.96 53.34,20.95 54.61,20.95
A8
  Top 0.254: IC4.17 66.67,19.68 66.04,19.05 59.05,19.05 58.42,19.68 IC5.17 54.61,19.68 | 54.61,19.68 53.98,19.68 | IC1.41 48.34,22.46 51.12,19.68 54.61,19.68
A9
  Top 0.254: IC4.18 66.67,18.41 66.04,17.78 59.05,17.78 58.42,18.41 IC5.18 54.61,18.41 | 54.61,18.41 53.98,18.41 | IC1.40 48.21,21.96 51.75,18.41 54.61,18.41
A10
  Top 0.254: IC4.20 72.39,19.68 71.75,20.32 66.67,20.32 66.04,19.68 64.77,19.68 | 64.77,19.68 IC5.20 | 64.77,19.68 59.05,19.68 58.42,20.32 53.34,20.32 49.7,23.96 IC1.44
A11
  Top 0.254: IC4.21 72.39,20.95 71.75,21.59 66.67,21.59 66.04,20.95 64.77,20.95 | 64.77,20.95 IC5.21 | 64.77,20.95 59.05,20.95 58.42,21.59 53.34,21.59 49.47,25.46 IC1.47
A12
  Top 0.254: IC4.22 72.39,22.23 71.75,22.86 66.67,22.86 66.04,22.23 64.77,22.23 | 64.77,22.23 IC5.22 | 64.77,22.23 59.05,22.23 58.42,22.86 53.34,22.86 48.74,27.46 IC1.51
A13
  Top 0.254: IC4.23 72.39,23.5 71.75,24.13 66.67,24.13 66.04,23.5 64.77,23.5 | 64.77,23.5 IC5.23 | 64.77,23.5 59.05,23.5 58.42,24.13 53.34,24.13 49.01,28.46 IC1.53
A14  (via drill 0.6)
  Top 0.254: IC4.24 72.71,24.77 72.07,25.4 66.67,25.4 66.04,24.77 IC5.24 59.37,24.77 58.74,25.4 53.34,25.4 52.7,26.04 v52.7,26.99 | IC1.57 49.19,30.46 v49.85,31.11
  Bottom 0.254: v49.85,31.11 50.48,31.11 52.07,29.53 52.07,27.62 v52.7,26.99
A15
  Top 0.254: IC4.32 72.39,34.92 71.75,35.56 66.67,35.56 66.04,34.92 64.77,34.92 | 64.77,34.92 IC5.32 | 64.77,34.92 58.42,34.92 57.78,35.56 51.12,35.56 49.02,33.46 IC1.63
A16
  Top 0.254: IC4.33 72.39,36.2 71.75,36.83 66.67,36.83 66.04,36.2 64.77,36.2 | 64.77,36.2 IC5.33 | 64.77,36.2 58.42,36.2 57.78,36.83 50.8,36.83 50.43,36.46 IC1.69
A17
  Top 0.254: IC4.34 72.39,37.47 71.75,38.1 66.67,38.1 66.04,37.47 64.77,37.47 | 64.77,37.47 IC5.34 | 64.77,37.47 58.42,37.47 57.78,38.1 51.44,38.1 48.58,40.96 45.4,40.96 44.95,40.5 IC1.73
A18
  Top 0.254: IC4.35 72.39,38.73 71.75,39.37 66.67,39.37 66.04,38.73 64.77,38.73 | 64.77,38.73 IC5.35 | 64.77,38.73 58.42,38.73 57.78,39.37 51.44,39.37 48.58,42.23 44.45,42.23 43.45,41.22 IC1.76
D0  (via drill 0.6)
  Top 0.254: v71.12,32.07 70.8,32.38 IC4.7 | v73.34,16.51 70.48,13.65 66.04,13.65 61.91,9.53 45.09,9.53 38.45,16.16 IC1.23
  Bottom 0.254: v71.12,32.07 73.34,29.84 v73.34,16.51
D1  (via drill 0.6)
  Top 0.254: IC4.8 70.17,31.11 v70.48,30.8 | v72.39,17.46 72.39,16.51 70.17,14.29 65.72,14.29 61.59,10.16 45.09,10.16 38.95,16.3 IC1.24
  Bottom 0.254: v70.48,30.8 72.39,28.89 v72.39,17.46
D2  (via drill 0.6)
  Top 0.254: v71.44,27.3 IC4.11 | v71.12,16.83 69.22,14.92 65.41,14.92 61.28,10.79 45.09,10.79 39.45,16.43 IC1.25
  Bottom 0.254: v71.44,27.3 71.44,17.14 v71.12,16.83
D3  (via drill 0.6)
  Top 0.254: IC4.12 70.17,26.04 v70.48,26.35 | v69.85,17.14 68.26,15.56 65.09,15.56 60.96,11.43 45.09,11.43 39.95,16.57 IC1.26
  Bottom 0.254: v70.48,26.35 70.48,17.78 v69.85,17.14
D4  (via drill 0.6)
  Top 0.254: v76.83,26.04 IC4.25 | v77.15,16.51 77.15,16.19 72.07,11.11 67.31,11.11 63.18,6.99 45.09,6.99 35.45,16.62 IC1.17
  Bottom 0.254: v77.15,16.51 77.15,25.72 v76.83,26.04
D5  (via drill 0.6)
  Top 0.254: v76.2,27.3 IC4.26 | v76.2,17.46 76.2,16.19 71.75,11.75 66.99,11.75 62.87,7.62 45.09,7.62 35.95,16.76 IC1.18
  Bottom 0.254: v76.2,17.46 75.88,17.78 75.88,26.99 v76.2,27.3
D6  (via drill 0.6)
  Top 0.254: v75.56,31.11 IC4.29 | v75.25,16.51 75.25,16.19 71.44,12.38 66.67,12.38 62.55,8.26 45.09,8.26 36.95,16.39 IC1.20
  Bottom 0.254: v75.56,31.11 75.25,30.8 v75.25,16.51
D7  (via drill 0.6)
  Top 0.254: IC4.30 74.61,32.38 v74.3,32.07 | v74.3,17.46 74.3,16.19 71.12,13.02 66.36,13.02 62.23,8.89 45.09,8.89 37.45,16.53 IC1.21
  Bottom 0.254: v74.3,17.46 v74.3,32.07
D8  (via drill 0.6)
  Top 0.254: v58.42,31.11 57.15,32.38 IC5.7 | v59.37,15.88 58.1,14.61 45.09,14.61 42.95,16.75 IC1.32
  Bottom 0.254: v58.42,31.11 59.37,30.16 v59.37,15.88
D9  (via drill 0.6)
  Top 0.254: v56.52,30.48 55.88,31.11 IC5.8 | v58.42,16.83 56.83,15.24 45.09,15.24 43.45,16.88 IC1.33
  Bottom 0.254: v56.52,30.48 57.15,30.48 58.74,28.89 58.74,17.14 v58.42,16.83
D10  (via drill 0.6)
  Top 0.254: v57.78,26.35 57.78,26.67 57.15,27.3 IC5.11 | v56.83,16.51 56.2,15.88 45.72,15.88 44.45,17.15 IC1.35
  Bottom 0.254: v57.78,26.35 57.47,26.04 57.47,17.14 v56.83,16.51
D11  (via drill 0.6)
  Top 0.254: IC5.12 56.2,26.04 v56.52,26.35 | IC1.36 44.95,17.29 45.72,16.51 55.24,16.51 v55.56,16.83
  Bottom 0.254: v56.52,26.35 56.52,17.78 v55.56,16.83
D12  (via drill 0.6)
  Top 0.254: v62.87,25.72 63.18,26.04 IC5.25 | v63.18,15.88 63.18,14.61 60.64,12.06 45.09,12.06 40.45,16.7 IC1.27
  Bottom 0.254: v63.18,15.88 63.18,18.41 62.87,18.73 v62.87,25.72
D13  (via drill 0.6)
  Top 0.254: v62.23,26.99 62.55,27.3 IC5.26 | v62.23,16.83 62.23,14.61 60.33,12.7 45.09,12.7 40.95,16.84 IC1.28
  Bottom 0.254: v62.23,16.83 62.23,18.1 61.91,18.41 61.91,26.67 v62.23,26.99
D14  (via drill 0.6)
  Top 0.254: IC5.29 63.82,31.11 63.5,31.43 v61.28,31.43 | v61.28,15.88 61.28,14.61 60.01,13.34 45.09,13.34 41.95,16.48 IC1.30
  Bottom 0.254: v61.28,15.88 v61.28,31.43
D15  (via drill 0.6)
  Top 0.254: IC5.30 60.64,32.38 60.33,32.07 60.01,31.75 v60.01,31.11 | v60.33,16.83 60.33,15.24 59.05,13.97 45.09,13.97 42.45,16.61 IC1.31
  Bottom 0.254: v60.33,16.83 60.33,30.8 v60.01,31.11
DAC0  (via drill 0.6)
  Top 0.254: IC1.108 27.45,40.18 27.3,40.32 v16.83,40.32
  Bottom 0.254: v16.83,40.32 16.19,40.32 15.56,39.69 IC2.10
DAC1  (via drill 0.6)
  Top 0.254: IC1.107 27.95,40.95 27.62,41.27 15.56,41.27 v15.24,40.96
  Bottom 0.254: v15.24,40.96 14.29,40.01 IC2.9
DAC2  (via drill 0.6)
  Top 0.254: IC1.112 24.08,36.46 23.18,35.56 14.29,35.56 v13.02,36.83
  Bottom 0.254: v13.02,36.83 IC2.8
DAC3  (via drill 0.6)
  Top 0.254: IC1.113 24.21,35.96 23.18,34.92 13.65,34.92 v11.75,36.83
  Bottom 0.254: v11.75,36.83 IC2.7
DAC4  (via drill 0.6)
  Top 0.254: IC1.116 12.85,34.46 v10.48,36.83
  Bottom 0.254: v10.48,36.83 IC2.6
DAC5  (via drill 0.6)
  Top 0.254: IC1.118 12.58,33.46 v9.21,36.83
  Bottom 0.254: v9.21,36.83 IC2.5
DAC6  (via drill 0.6)
  Top 0.254: IC1.119 11.81,32.96 v7.94,36.83
  Bottom 0.254: v7.94,36.83 IC2.4
DAC7  (via drill 0.6)
  Top 0.254: IC1.122 12.04,31.46 v6.67,36.83
  Bottom 0.254: v6.67,36.83 IC2.3
DAC8  (via drill 0.6)
  Top 0.254: IC1.123 11.27,30.96 v5.4,36.83
  Bottom 0.254: v5.4,36.83 IC2.2
DAC9  (via drill 0.6)
  Top 0.254: IC1.129 8.59,27.96 6.99,26.35 3.49,26.35 v2.86,26.99
  Bottom 0.254: v2.86,26.99 2.86,34.29 4.13,35.56 IC2.1
DAC_CLK  (via drill 0.6)
  Top 0.254: IC1.128 8.14,28.46 6.67,26.99 5.08,26.99 v4.13,27.94
  Bottom 0.254: IC2.28 v4.13,27.94
FCCLK  (via drill 0.6)
  Top 0.254: IC1.72 47.17,37.96 47.62,38.42 47.62,39.69 v47.31,40.01
  Bottom 0.254: IC3.3 61.31,34.01 60.01,32.7 55.88,32.7 55.56,32.38 51.44,32.38 51.12,32.7 51.12,33.97 47.62,37.47 47.62,39.69 v47.31,40.01
FDIN  (via drill 0.6)
  Top 0.254: IC1.65 48.11,34.46 v48.58,34.92
  Bottom 0.254: v48.58,34.92 49.21,34.92 50.48,33.66 50.48,32.38 51.12,31.75 55.88,31.75 56.2,32.07 60.33,32.07 61.91,33.66 62.23,33.66 62.62,34.04 IC3.1
FDONE  (via drill 0.6)
  Top 0.254: IC1.71 49.52,37.46 v50.16,38.1
  Bottom 0.254: IC3.10 56.77,34.22 56.52,33.97 53.34,33.97 50.16,37.15 v50.16,38.1 50.16,40.96 48.58,42.55 R17.1
FINIT  (via drill 0.6)
  Top 0.254: 48.42,30.96 IC1.58 | 48.42,30.96 50.8,33.34 v52.07,33.34 | 48.42,30.96 45.56,30.96 v45.4,30.8
  Bottom 0.254: IC3.8 58.06,33.62 57.78,33.34 v52.07,33.34 | v45.4,30.8 45.4,30.16 46.67,28.89 R16.1
FPRG  (via drill 0.6)
  Top 0.254: IC1.143 24.45,20.96 24.13,20.64 24.13,19.37 v26.04,17.46 | v41.91,41.59 43.81,43.5 49.21,43.5 v50.64,42.07 v51.91,40.8
  Bottom 0.254: v41.91,41.59 29.21,41.59 26.35,38.73 26.35,20 26.99,19.37 26.99,18.41 v26.04,17.46 | IC3.7 58.72,35.58 58.58,35.72 56.67,35.72 55.56,34.61 53.5,34.61 52.39,35.72 51.91,36.2 v51.91,40.8 | R15.1 49.53,45.09 50.32,44.29 | 50.32,44.29 50.64,43.97 | 50.32,44.29 | v50.64,42.07 50.64,43.97 | 50.64,43.97 50.32,44.29
FTCK  (via drill 0.6)
  Top 0.254: IC1.110 23.82,37.46 v22.86,38.42 | v36.99,44.77 v38.89,46.67
  Bottom 0.254: v22.86,38.42 22.86,40.32 26.67,44.13 36.35,44.13 v36.99,44.77 | IC3.6 59.37,35.87 60.33,36.83 62.23,36.83 63.18,37.78 63.18,41.91 62.71,42.39 60.33,42.39 60.17,42.55 IC6.4 60.17,46.35 58.74,47.78 53.34,47.78 | v38.89,46.67 39.21,46.99 52.55,46.99 53.34,47.78 | 53.34,47.78 54.61,47.78 | 54.61,47.78 | R10.2 54.61,47.78
FTDI  (via drill 0.6)
  Top 0.254: IC1.144 25.22,20.46 25.08,20.32 25.08,19.68 v26.04,18.73 | v41.91,42.86 42.55,42.86 43.81,44.13 49.85,44.13 v53.18,40.8
  Bottom 0.254: v26.04,18.73 25.72,19.05 25.72,39.05 29.21,42.55 41.59,42.55 v41.91,42.86 | 54.13,40.64 R8.2 54.13,40.8 v53.18,40.8
FTDI2  (via drill 0.6)
  Top 0.254: SV1.9 76.83,44.45 76.2,43.81 66.36,43.81 65.25,42.7 | v65.09,42.7 65.25,42.7 | 65.25,42.7
  Bottom 0.254: IC3.4 60.66,35.27 60.96,35.56 63.18,35.56 65.41,37.78 65.41,42.39 v65.09,42.7
FTDO  (via drill 0.6)
  Top 0.254: IC1.109 24.59,37.96 24.13,38.42 v24.13,39.05 | v38.26,43.5 v40.8,46.04
  Bottom 0.254: v24.13,39.05 24.13,40.01 27.62,43.5 35.56,43.5 35.88,43.18 37.94,43.18 v38.26,43.5 | v40.8,46.04 41.27,46.51 52.7,46.51 53.34,47.15 | IC6.5 58.9,46.35 57.94,47.31 53.5,47.31 53.34,47.15 | 53.34,47.15 53.5,47.31
FTMS  (via drill 0.6)
  Top 0.254: IC1.111 22.41,36.96 v21.91,37.47 | v42.86,44.45 43.18,44.45 43.5,44.77 49.53,44.77 49.85,45.09 51.12,45.09 v54.93,41.27 60.33,41.27 61.59,42.55 63.5,42.55 v64.45,41.59
  Bottom 0.254: v21.91,37.47 21.91,40.64 26.04,44.77 32.7,44.77 33.66,45.72 39.37,45.72 40.64,44.45 v42.86,44.45 | IC3.5 60.02,35.57 60.64,36.2 62.55,36.2 63.82,37.47 63.82,40.96 v64.45,41.59 64.29,41.59 62.71,43.18 IC6.2 | R9.2 53.81,42.39 v54.93,41.27
GND  (via drill 0.6)
  Top 0.254: IC5.10 53.98,28.57 | IC1.67 45.19,35.46 v44.77,35.88 | v44.77,33.97 44.77,33.66 45.07,33.96 IC1.64 | IC1.81 40.95,38.09 40.64,37.78 v40.32,37.78 | IC1.88 37.45,38.08 v37.15,37.78 | IC1.94 34.45,37.94 v34.29,37.78 | IC1.101 30.95,37.95 v31.11,37.78 | IC1.114 27.2,35.46 v27.3,35.56 | IC1.117 27,33.96 v27.3,33.66 | IC1.136 27,24.46 v27.3,24.77 | IC1.139 27.2,22.96 v27.3,22.86 | IC1.142 27.18,21.46 v27.3,21.59 | IC1.9 31.45,20.62 v31.43,20.64 | IC1.16 34.95,20.62 34.61,20.95 v34.61,20.64 | IC1.22 37.95,20.48 v37.78,20.64 | IC1.29 41.45,20.47 41.27,20.64 v40.96,20.64 | IC1.37 45.26,20.46 v44.77,20.95 | IC1.39 45.27,21.46 v44.77,20.95 | IC1.42 44.87,22.96 44.77,22.86 v44.77,22.54 | v44.77,24.77 45.07,24.46 IC1.45 | IC1.38 v44.77,20.96 v44.77,20.95 | 58.1,46.67 C27.2
  Top 0.406: C32.2 52.7,28.57 53.98,28.57
  Top 0.61: v66.67,28.57 IC4.10 | v62.55,28.57 61.91,27.94 56.2,27.94 55.56,28.57 IC5.10 | v1.27,31.75 v4.13,31.75
  Top 0.813: 58.1,46.67 57.31,46.67 v56.52,45.88 | 58.42,46.67 60.17,44.93 63.66,44.93 | SV1.2 66.67,47.94 63.66,44.93 | 63.66,44.93
  Top 1.016: 58.42,46.67 58.1,46.67
  Top 1.27: v31.43,20.64 v34.61,20.64 | v38.73,24.45 v33.66,24.45 | v37.78,20.64 v40.96,20.64 | v44.77,27.94 41.91,27.94 40.01,29.84 v38.73,29.84 | v49.53,51.91 JP2.19 | JP3.5 v68.26,1.27 v81.28,1.27 v81.28,51.91 v75.25,51.91 v65.41,51.91 v52.07,51.91 v49.53,51.91 | v49.53,51.91 v1.27,51.91 v1.27,31.75 v1.27,13.34
  Bottom 0.254: C10.2 33.66,27.62 33.76,27.52 C12.2 33.76,24.55 v33.66,24.45 | 33.66,32.38 C13.2 33.76,32.28 33.66,32.38 | C11.2 33.55,32.28 33.66,32.38 | C9.2 38.84,30.7 38.73,30.8 38.73,31.11 C8.2 38.84,32.28 38.73,32.38 38.63,32.28 C14.2 | C15.2 38.63,24.55 v38.73,24.45
  Bottom 0.305: C19.2 35.98,20.74 35.88,20.64 | C3.2 27.41,24.87 v27.3,24.77 | C5.2 27.73,33.23 v27.3,33.66 | C6.2 33.23,37.68 33.34,37.78 | C7.2 39.27,37.68 39.37,37.78 | C17.2 44.66,32.92 44.77,33.02 | 44.77,26.67 C16.2
  Bottom 0.406: C31.2 67.84,26.77 66.67,27.94 | C26.2 58.74,41.59 58.42,41.27 56.77,41.27
  Bottom 0.61: 7.62,31.75 6.99,31.75 6.67,31.43 IC2.26 6.67,28.89 7.62,27.94 | v62.55,28.57 v66.67,28.57 66.67,27.94 66.67,14.61 | 7.62,27.94 7.94,28.26 IC2.25 7.94,31.43 7.62,31.75 | 7.62,27.94 7.94,27.94 | C21.- 28.3,15.6 28.26,15.56 | 27.94,1.27 27.94,6.67 | 30.48,1.27 30.48,6.67 27.94,6.67 | v4.13,31.75 7.62,31.75 | 25.4,1.27 25.4,6.67 27.94,6.67 | v56.52,45.88 56.36,45.72 IC6.7 56.36,41.91 56.77,41.5 56.77,41.27 IC3.11
  Bottom 0.813: IC7.6 IC7.3 55.56,10.16 | v75.25,51.91 75.25,50.16 SV1.10 | v65.41,51.91 65.41,49.85 SV1.2 | C28.2 80.96,35.75 80.96,35.88 | C29.2 7.3,26.35 7.62,26.67 7.62,27.94 | v52.07,51.91
  Bottom 1.016: 81.28,35.88 80.96,35.88 IC8.2
  Bottom 1.27: v44.77,20.95 44.77,20.64 | v44.77,20.95 v44.77,22.54 v44.77,24.77 44.77,26.67 v44.77,27.94 | 44.77,33.02 v44.77,33.97 v44.77,35.88 44.77,37.78 v40.32,37.78 39.37,37.78 v37.15,37.78 v34.29,37.78 33.34,37.78 v31.11,37.78 27.3,37.78 v27.3,35.56 v27.3,33.66 v27.3,24.77 v27.3,22.86 v27.3,21.59 27.3,20.64 28.57,20.64 | 28.57,20.64 v31.43,20.64 | v34.61,20.64 35.88,20.64 v37.78,20.64 | v40.96,20.64 40.96,22.23 v38.73,24.45 v38.73,29.84 38.73,30.8 38.73,32.38 | v33.66,24.45 33.66,27.62 33.66,32.38 | v44.77,20.95 46.04,20.95 47.59,19.41 C22.- 47.59,14.64 47.62,14.61 47.59,14.56 C25.- 47.9,14.61 | C21.- 28.3,20.36 28.57,20.64 | JP3.5 JP3.4 | JP3.5 JP3.6 75.56,3.81 IC10.4 IC10.2 75.56,12.7 | 75.56,12.7 C24.2 | 64.14,10.16 IC7.6 63.82,11.75 66.67,14.61 81.28,14.61 | 55.56,10.16 C20.2 C18.2 | 75.56,12.7 C23.2 | 27.94,6.67 27.94,15.24 28.26,15.56 28.26,15.88 | v1.27,13.34 1.27,1.27 25.4,1.27 27.94,1.27 30.48,1.27 v68.26,1.27 | v1.27,13.34 v1.27,31.75 v1.27,51.91 v49.53,51.91 v52.07,51.91 v65.41,51.91 v75.25,51.91 v81.28,51.91 81.28,35.88 81.28,14.61 | 81.28,14.61 v81.28,1.27 v68.26,1.27 | v68.26,1.27 JP3.5 | v1.27,13.34 JP5.1
  pour Top (isolate 0.305, rank 2): 1.27,1.27 81.28,1.27 81.28,51.91 1.27,51.91 1.27,26.35 1.27,8.57
  pour Bottom (isolate 0.305, rank 2): 1.27,6.03 1.27,1.27 81.28,1.27 81.28,51.91 1.27,51.91 1.27,26.35
GNDA  (via drill 0.6)
  Top 0.61: v6.67,13.34 12.38,13.34 15.88,16.83 17.14,18.1 v17.14,22.54
  Bottom 0.254: R2.1 14.47,24.64 14.61,24.77 14.73,24.64 | 17.14,24.77 17.27,24.64 | 19.5,24.64 C4.2 19.37,24.45 | 9.84,25.72 10.16,25.72 | v6.67,23.5 v2.86,23.5 2.86,20.48 v2.86,18.73 | v6.67,13.34 v6.67,11.43 v2.86,11.43
  Bottom 0.305: C1.2 6.54,21.14 6.99,21.59 | 9.21,21.59 IC9.2 6.99,21.59 | 6.99,21.59 | 6.99,21.59 6.51,21.11 6.51,20.48 2.86,20.48
  Bottom 0.406: C30.2 9.84,25.72 7.62,23.5 v6.67,23.5 | C1.2 6.03,19.21
  Bottom 0.61: IC2.21 13.02,31.43 13.34,31.75 13.97,31.75 14.29,31.43 | 14.29,31.43 IC2.20 | 14.29,31.43 14.61,31.75 19.05,31.75 19.37,31.43 | 19.37,31.43 IC2.16 | 19.37,31.43 19.68,31.75 21.27,31.75 21.59,31.43 21.59,24.77 21.27,24.45 19.37,24.45 | R11.2 14.73,24.64 | 17.27,24.64 C4.2 | X1.2@2 6.51,15.88 6.67,15.72 v6.67,13.34
  Bottom 0.813: R11.2 17.02,24.64 17.14,24.77 v17.14,22.54
  Bottom 1.27: v6.67,13.34 JP5.2
  pour Bottom (isolate 0.305): 1.91,6.67 11.75,6.67 14.13,9.05 14.13,13.49 24.13,23.5 24.13,32.38 22.23,34.29 10.95,34.29 9.21,32.54 9.21,26.35 7.62,24.77 1.91,24.77
  pour Top (isolate 0.305): 1.91,24.77 7.62,24.77 9.53,26.67 17.46,26.67 17.78,26.35 17.78,12.7 14.29,9.21 11.91,6.67 1.91,6.67
N$3
  Bottom 0.305: R5.2 4.45,21.59 5.09,22.24 IC9.5
N$4
  Bottom 0.254: IC2.17 18.1,29.21 19.05,28.26 19.37,28.26 C4.1
N$6
  Bottom 0.406: R5.1 4.45,18.73 5.71,17.46 10.16,17.46 X1.1
N$7
  Bottom 0.254: IC8.3 71.12,37.15 70.17,38.1 67.94,38.1 R7.1
N$8
  Bottom 0.254: IC3.17 60.66,39.08 58.1,36.51 | 58.1,36.51 57.81,36.22 | R8.1 57.81,36.22 | 57.81,36.22 58.1,36.51
N$9
  Bottom 0.254: 14.29,27.3 14.16,27.43
  Bottom 0.305: IC2.22 11.75,27.62 12.06,27.3 | R2.2 14.29,27.3 12.06,27.3 | 12.06,27.3 11.75,26.99 11.75,24.61 10.95,23.81 9.37,22.23 9.35,22.24 IC9.1 9.19,22.24 9.21,22.23
N$12
  Bottom 0.254: 16.83,27.3 R11.1 IC2.18
RESET
  Top 0.254: IC1.85 38.95,41.17 39.69,41.91 39.69,42.39 42.7,45.4 | 42.7,45.4 | 42.7,45.4 43.81,46.51 48.58,46.51 49.05,46.99 50.16,46.99 JP2.20
TCK
  Bottom 0.254: IC6.3 61.44,45.24 62.23,46.04 SV1.1
TDO  (via drill 0.6)
  Top 0.254: 69.22,45.88 69.22,45.72 | 69.22,45.88 SV1.3 | 69.22,45.88 67.63,44.29 66.04,44.29 65.25,43.5 61.59,43.5 60.64,42.55 57.94,42.55 v57.63,42.23
  Bottom 0.254: R13.2 70.48,43.81 69.22,45.09 SV1.3 | v57.63,42.23 IC6.6
TMS  (via drill 0.6)
  Top 0.254: SV1.5 70.96,46.04 69.69,47.31 68.58,47.31 67.94,46.67 67.94,45.4 67.31,44.77 65.41,44.77 v65.09,44.45
  Bottom 0.254: IC6.1 63.98,43.97 64.45,44.45 v65.09,44.45
UC0
  Top 0.254: IC1.137 23.32,23.96 21.59,22.23 21.59,12.06 13.97,4.45 JP1.5
UC1
  Top 0.254: IC1.140 23.73,22.46 22.23,20.95 22.23,10.79 16.51,5.08 JP1.6
UC2
  Top 0.254: IC1.141 23.86,21.96 22.86,20.95 22.86,8.89 19.05,5.08 JP1.7
UC3
  Top 0.254: IC1.1 27.45,10.94 21.59,5.08 JP1.8
UC4
  Top 0.254: IC1.2 27.95,8.89 24.13,5.08 JP1.9
UC5
  Top 0.254: IC1.4 28.95,7.36 26.67,5.08 JP1.10
UC6
  Top 0.254: IC1.5 29.45,5.95 29.21,5.71 JP1.11
UC7
  Top 0.254: IC1.6 29.95,10.06 31.75,8.26 JP1.12
UC8
  Top 0.254: IC1.7 30.45,11.46 34.29,7.62 JP1.13
UC9
  Top 0.254: IC1.8 30.95,12.87 36.83,6.99 JP1.14
UC10
  Top 0.254: IC1.10 31.95,13.14 34.61,10.48 36.51,10.48 39.37,7.62 JP1.15
UC11
  Top 0.254: IC1.11 32.45,13.91 35.24,11.11 36.83,11.11 41.91,6.03 JP1.16
UC12
  Top 0.254: IC1.12 32.95,14.04 35.24,11.75 37.78,11.75 44.45,5.08 JP1.17
UC13  (via drill 0.6)
  Top 0.254: IC1.13 33.45,14.81 v35.56,12.7
  Bottom 0.254: v35.56,12.7 41.91,6.35 45.72,6.35 46.99,5.08 JP1.18
UC14  (via drill 0.6)
  Top 0.254: IC1.14 33.95,15.59 v35.56,13.97
  Bottom 0.254: v35.56,13.97 42.55,6.99 48.26,6.99 49.53,5.71 JP1.19
UC15  (via drill 0.6)
  Top 0.254: IC1.15 34.45,16.36 v36.83,13.97
  Bottom 0.254: v36.83,13.97 43.18,7.62 50.16,7.62 52.07,5.71 JP1.20
UC_/RD
  Top 0.254: IC1.125 8.14,29.96 3.49,34.61 3.49,46.35 3.81,46.67 JP2.1
UC_/WR
  Top 0.254: IC1.124 8.59,30.46 4.13,34.92 4.13,43.81 6.35,46.04 JP2.2
UC_A0
  Top 0.254: IC1.135 23.05,24.96 20.95,22.86 20.95,12.7 14.29,6.03 12.38,6.03 11.43,5.08 JP1.4
UC_A1
  Top 0.254: IC1.132 23.29,26.46 20.32,23.5 20.32,13.02 13.97,6.67 10.48,6.67 8.89,5.08 JP1.3
UC_A2
  Top 0.254: IC1.131 22.52,26.96 19.68,24.13 19.68,13.34 13.65,7.3 8.57,7.3 6.35,5.08 JP1.2
UC_A3
  Top 0.254: IC1.130 21.75,27.46 19.05,24.77 19.05,13.65 13.34,7.94 6.99,7.94 3.81,4.76 JP1.1
UC_A4
  Top 0.254: IC1.105 28.95,40.91 27.94,41.91 14.29,41.91 8.89,47.31 JP2.3
UC_A5
  Top 0.254: IC1.104 29.45,41.36 28.26,42.55 16.19,42.55 11.43,47.31 JP2.4
UC_A6
  Top 0.254: IC1.103 29.95,41.81 28.57,43.18 18.1,43.18 13.97,47.31 JP2.5
UC_A7
  Top 0.254: IC1.102 30.45,42.26 28.89,43.81 20,43.81 16.51,47.31 JP2.6
UC_A8
  Top 0.254: IC1.100 31.45,41.9 28.89,44.45 21.91,44.45 19.05,47.31 JP2.7
UC_A9
  Top 0.254: IC1.99 31.95,42.35 29.21,45.09 23.81,45.09 21.59,47.31 JP2.8
UC_A10
  Top 0.254: IC1.98 32.45,42.8 29.53,45.72 25.72,45.72 24.13,47.31 JP2.9
UC_A11
  Top 0.254: IC1.97 32.95,42.94 29.53,46.35 27.62,46.35 26.67,47.31 JP2.10
UC_A12
  Top 0.254: IC1.96 33.45,43.07 29.21,47.31 JP2.11
UC_A13
  Top 0.254: IC1.95 33.95,45.11 31.75,47.31 JP2.12
UC_A14
  Top 0.254: IC1.93 34.95,46.65 34.29,47.31 JP2.13
UC_A15
  Top 0.254: IC1.92 35.45,46.24 36.83,47.62 JP2.14
UC_A16
  Top 0.254: IC1.90 36.45,41.34 36.04,41.75 36.04,45.56 JP2.15
UC_A17
  Top 0.254: IC1.89 36.95,43.45 41.91,48.42 JP2.16
UC_A18
  Top 0.254: IC1.87 37.95,41.91 44.45,48.42 JP2.17
UC_CS
  Top 0.254: IC1.86 38.45,41.78 43.66,46.99 46.04,46.99 46.99,47.94 JP2.18

### Text on the board
Top: www.oxed.de | MiniGA_V1.1
Bottom: MiniGA_V1.1 | www.oxed.de